# EAGLE schematic servo_mp3 (EAGLE 9.0.0)
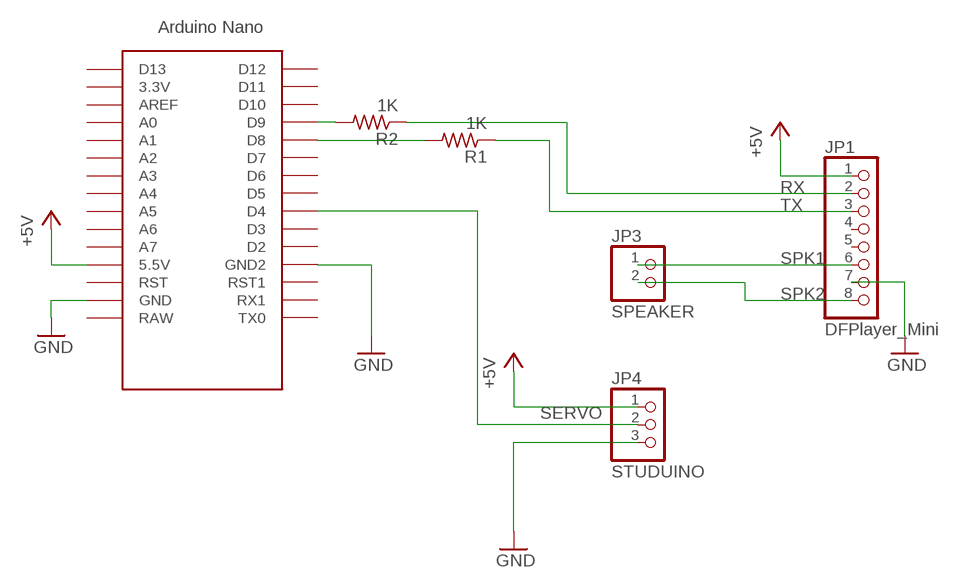
[diagram p0: schematic, sheet 1]

## Parts
JP1  DFPlayer_Mini  PINHD-1X8  [1X08]
JP3  SPEAKER  PINHD-1X2  [1X02]
JP4  STUDUINO  PINHD-1X3  [1X03]
R1  1K  R-US_0207/12  [0207/12]
R2  1K  R-US_0207/12  [0207/12]
U$1  NANO  [NANO]

## Nets
+5V: JP1.1 JP4.1 U$1.5V(5.5V)
GND: JP1.7 JP4.3 U$1.GND U$1.GND1(GND2)
N$5: R2.2 U$1.D9
N$6: R1.2 U$1.D8
RX: JP1.2 R2.1
SERVO: JP4.2 U$1.D4
SPK1: JP1.6 JP3.1
SPK2: JP1.8 JP3.2
TX: JP1.3 R1.1
Unconnected: JP1.4 JP1.5 U$1.3.3V U$1.A0 U$1.A1 U$1.A2 U$1.A3 U$1.A4 U$1.A5 U$1.A6 U$1.A7 U$1.AREF U$1.D2 U$1.D3 U$1.D5 U$1.D6 U$1.D7 U$1.D10 U$1.D11 U$1.D12 U$1.D13 U$1.ICSP1 U$1.ICSP2 U$1.ICSP3 U$1.ICSP4 U$1.ICSP5 U$1.ICSP6 U$1.RAW U$1.RST U$1.RST1 U$1.RX1 U$1.TX0

## Library data of the parts
JP1 = pinhead:PINHD-1X8: PIN HEADER
JP3 = pinhead:PINHD-1X2: PIN HEADER
JP4 = pinhead:PINHD-1X3: PIN HEADER
R1 R2 = resistor:R-US_: RESISTOR, American symbol
U$1 = Arduino-clone:NANO: Arduino Nano